# Altium schematic sheet air.SchDoc: air
size A4; Date: 05.10.2017; CheckedBy: Nico Bieberich; Author: Leon Loeser; Organization: Baltic Racing; Address1: Zur Schwedenschanze 15; Address2: Haus 18; Address3: 18435 Stralsund; Revision: xx.xx; SheetNumber: 7; SheetTotal: 9; Rules: TODO; ProjectName: Projekt
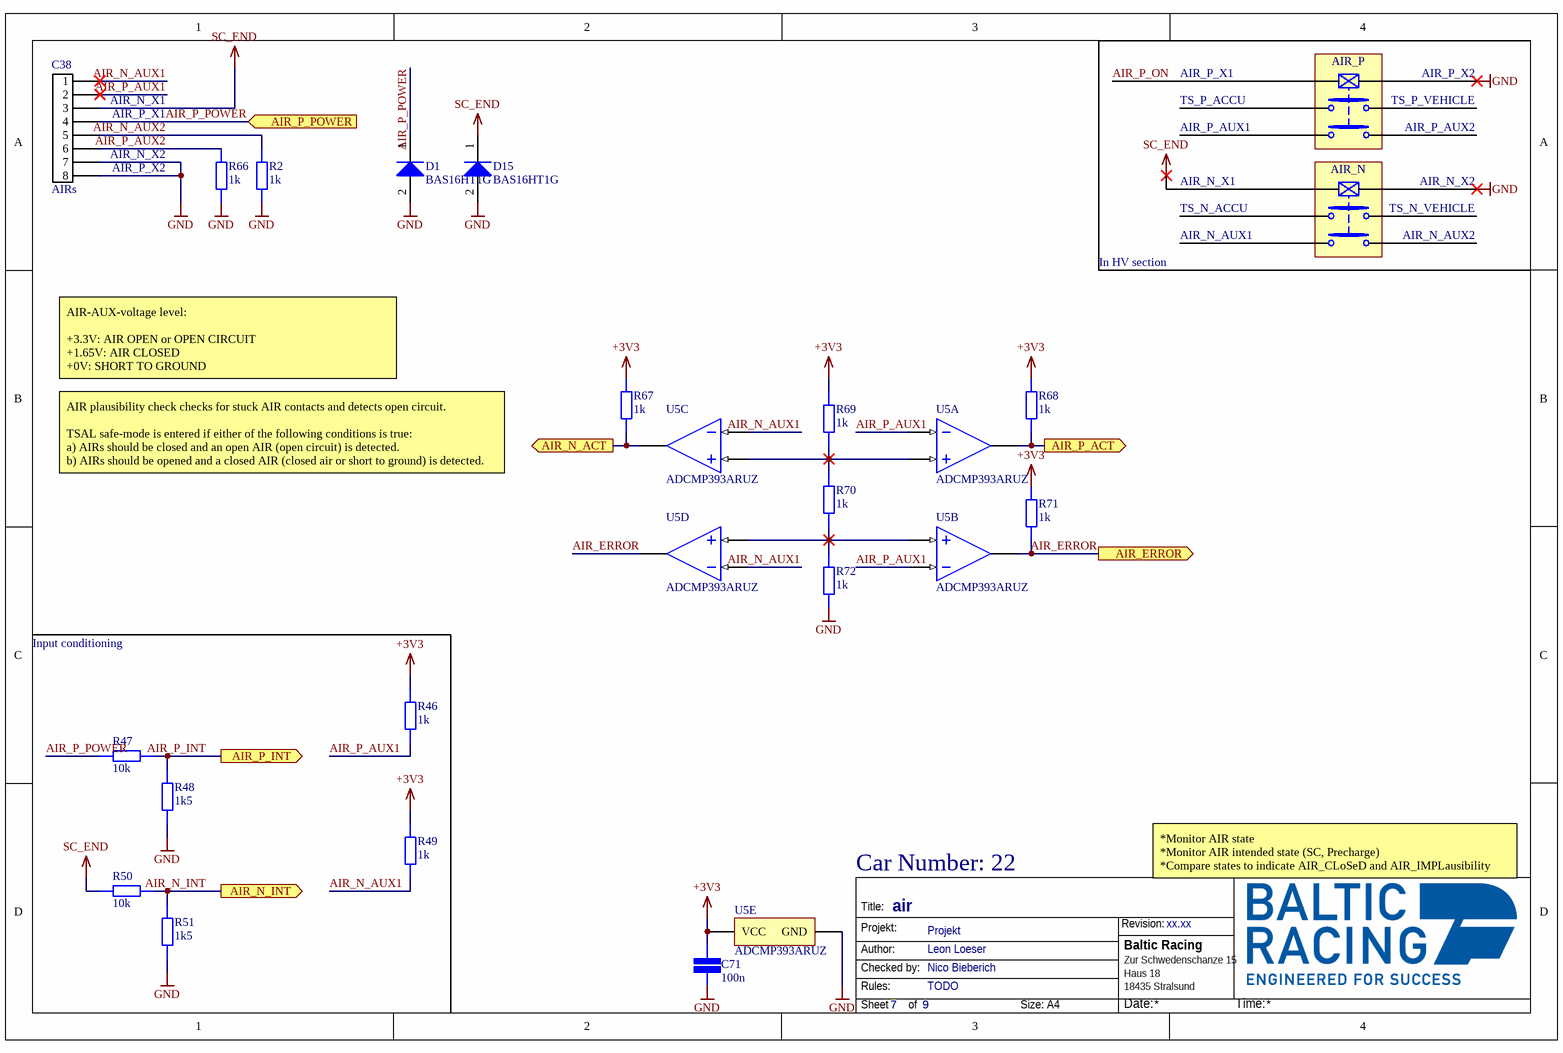
[diagram p0: air.SchDoc]

## Parts
C38  AIRs  [43045-0812]
C71  value 100n  [CAP 0603/1608]  (hidden comment: SMD Capacitor)
D1  BAS16HT1G  [ONSC-SOD-323-2-477-02_V]
D15  BAS16HT1G  [ONSC-SOD-323-2-477-02_V]
R2  value 1k  [STACKPOLE CSR0603]  (hidden comment: SMD Resistor)
R46  value 1k  [STACKPOLE CSR0603]  (hidden comment: SMD Resistor)
R47  value 10k  [STACKPOLE CSR0603]  (hidden comment: SMD Resistor)
R48  value 1k5  [STACKPOLE CSR0603]  (hidden comment: SMD Resistor)
R49  value 1k  [STACKPOLE CSR0603]  (hidden comment: SMD Resistor)
R50  value 10k  [STACKPOLE CSR0603]  (hidden comment: SMD Resistor)
R51  value 1k5  [STACKPOLE CSR0603]  (hidden comment: SMD Resistor)
R66  value 1k  [STACKPOLE CSR0603]  (hidden comment: SMD Resistor)
R67  value 1k  [STACKPOLE CSR0603]  (hidden comment: SMD Resistor)
R68  value 1k  [STACKPOLE CSR0603]  (hidden comment: SMD Resistor)
R69  value 1k  [STACKPOLE CSR0603]  (hidden comment: SMD Resistor)
R70  value 1k  [STACKPOLE CSR0603]  (hidden comment: SMD Resistor)
R71  value 1k  [STACKPOLE CSR0603]  (hidden comment: SMD Resistor)
R72  value 1k  [STACKPOLE CSR0603]  (hidden comment: SMD Resistor)
U5  ADCMP393ARUZ  [ANALOG_RU14]  (parts A,B,C,D,E of 5)

## Ports
AIR_ERROR (out), AIR_N_ACT (out), AIR_N_INT (out), AIR_P_ACT (out), AIR_P_INT (out), AIR_P_POWER (in)

## Nets
+3V3: C71.1 R46.2 R49.2 R67.2 R68.2 R69.2 R71.2 U5.3(VCC)
GND: C38.7 C38.8 C71.2 D1.2(A) D15.2(A) R2.1 R48.1 R51.1 R66.1 R72.1 U5.12(GND)
SC_END: C38.3 D15.1(K) R50.2
AIR_ERROR: R71.1 U5.1(OUT_B) U5.13(OUT_D) ; port AIR_ERROR
AIR_N_ACT: R67.1 U5.14(OUT_C) ; port AIR_N_ACT
AIR_N_AUX1: C38.1 R49.1 U5.8(-IN_C) U5.10(-IN_D)
AIR_N_AUX2: C38.5 R2.2
AIR_N_INT: R50.1 R51.2 ; port AIR_N_INT
AIR_P_ACT: R68.1 U5.2(OUT_A) ; port AIR_P_ACT
AIR_P_AUX1: C38.2 R46.1 U5.4(-IN_A) U5.6(-IN_B)
AIR_P_AUX2: C38.6 R66.2
AIR_P_INT: R47.1 R48.2 ; port AIR_P_INT
AIR_P_POWER: C38.4 D1.1(K) R47.2 ; port AIR_P_POWER
NetR69_1: R69.1 R70.2 U5.5(+IN_A) U5.9(+IN_C)
NetR70_1: R70.1 R72.2 U5.7(+IN_B) U5.11(+IN_D)

## Notes on the sheet
- (near C38) AIR_N_X1
- AIR_P_X1
- AIR_P_ON
- TS_P_ACCU
- AIR_P
- TS_P_VEHICLE
- AIR_P_X2
- AIR_N_X2
- AIR_P_AUX1
- AIR_N_X1
- AIR_N
- AIR_P_AUX2
- TS_N_ACCU
- AIR_N_AUX1
- TS_N_VEHICLE
- AIR_N_AUX2
- In HV section
- AIR-AUX-voltage level:
  +3.3V: AIR OPEN or OPEN CIRCUIT
  +1.65V: AIR CLOSED
  +0V: SHORT TO GROUND
- AIR plausibility check checks for stuck AIR contacts and detects open circuit.
  TSAL safe-mode is entered if either of the following conditions is true:
  a) AIRs should be closed and an open AIR (open circuit) is detected.
  b) AIRs should be opened and a closed AIR (closed air or short to ground) is detected.
- Input conditioning
- Car Number: 22
- *Monitor AIR state
  *Monitor AIR intended state (SC, Precharge)
  *Compare states to indicate AIR_CLoSeD and AIR_IMPLausibility
  *Generate SIG_TSAL
- Labels drawn without touching a wire or pin: GND, SC_END
- Title:
- Projekt:
- Revision:
- Author:
- Rules:
- Checked by:
- Sheet
- of
- Size:
- A4
- Date:
- Time:

## Library data of the parts
C38 = MicroFit3.0 8-Pin: Molex Micro-Fit 3.0 8-Pin / 600V / 8.5V
C71 = SMD Capacitor: Capacitor with multiple Footprints
D1 D15 = CMP-1054-00068-1: Switching Diode, 2-Pin SOD-323, Pb-Free, Tape and Reel; Manufacturer: On Semiconductor; Configuration: Single; IF Max (A): 0.2; trr Max (ns): 6; Packing: Tape and Reel; ComponentLink2URL: http://www.onsemi.com/pub_link/Collateral/BAS16HT1-D.PDF; ComponentLink3Description: Package Specification; RoHS: TRUE; PackageDescription: 2-Pin SOD, Body 1.7 x 1.25 mm; PackageReference: SOD-323-2-477-02; PartNumber: BAS16HT1G; ComponentLink1URL: http://www.onsemi.com/; Mounting Technology: Surface Mount; ComponentLink1Description: Manufacturer URL; ComponentLink2Description: Datasheet; DatasheetVersion: Rev. 11; PackageVersion: Rev. H, 03/2007; ComponentLink3URL: http://www.onsemi.com/pub_link/Collateral/477-02.PDF.1
R2 R46-R51 R66-R72 = SMD Resistor: Resistor with multiple footprints
U5 = ADCMP393ARUZ: 2.3V-5.5V Quad Comparator With Known Power-Up State and Open-Drain output